# Altium schematic sheet Sensor.SchDoc
size A4
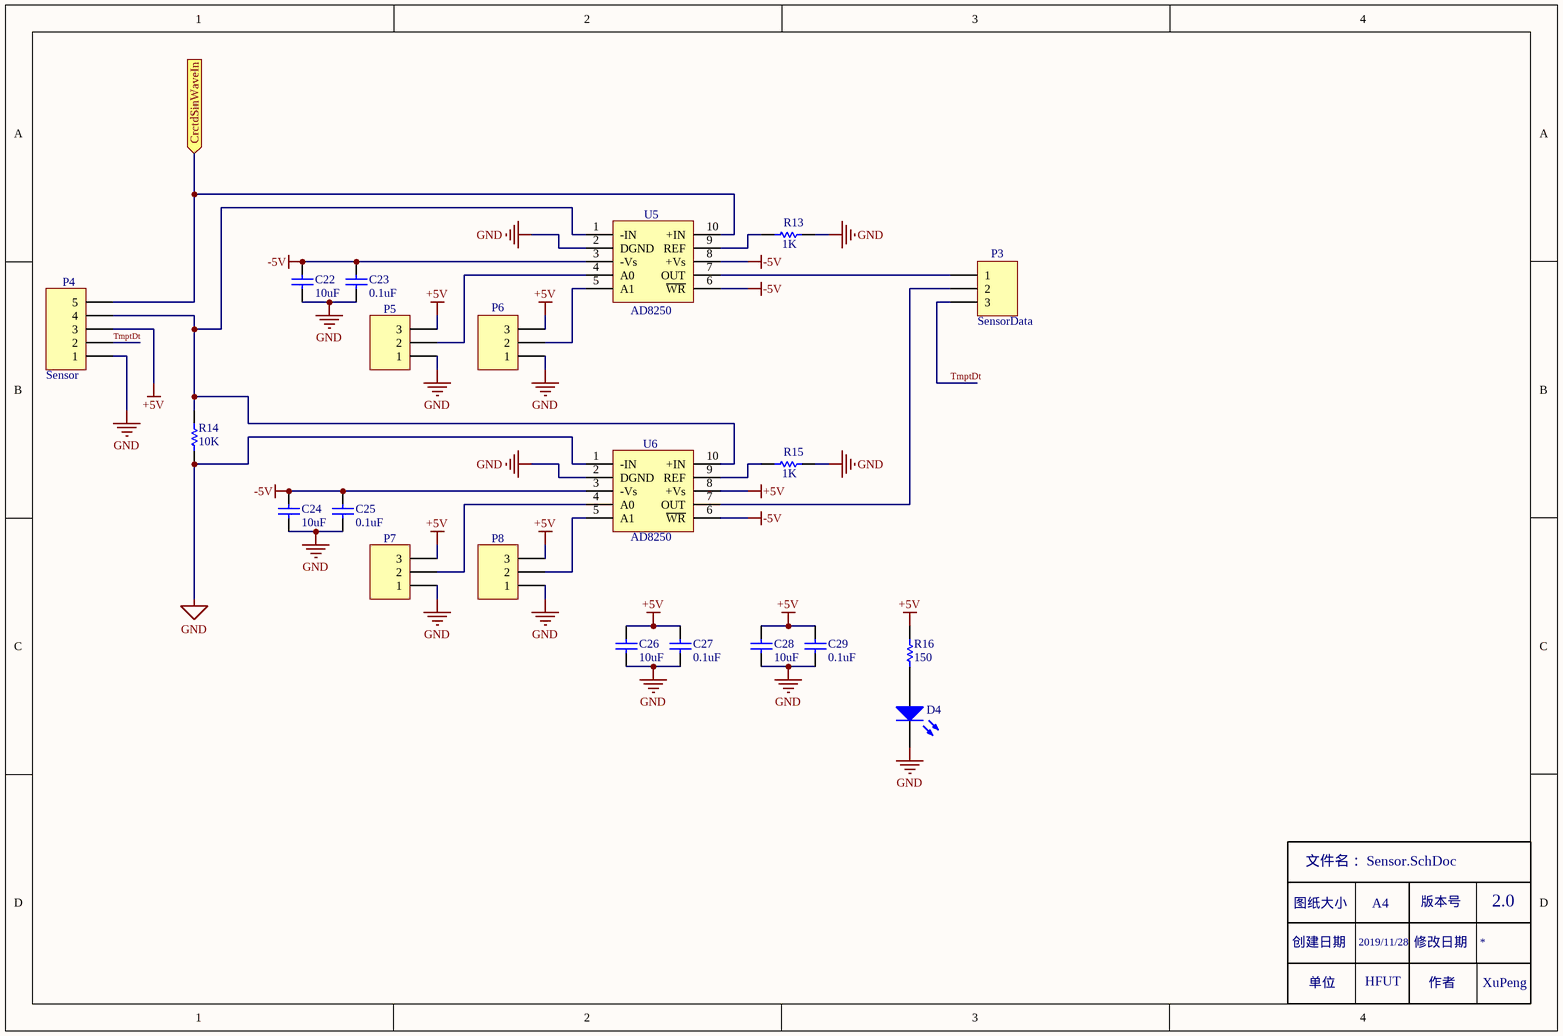
[diagram p0: Sensor.SchDoc]

## Parts
C22  value 10uF  [RB0.1/0.2]  (hidden comment: Cap)
C23  value 0.1uF  [C-RAD]  (hidden comment: Cap)
C24  value 10uF  [RB0.1/0.2]  (hidden comment: Cap)
C25  value 0.1uF  [C-RAD]  (hidden comment: Cap)
C26  value 10uF  [RB0.1/0.2]  (hidden comment: Cap)
C27  value 0.1uF  [C-RAD]  (hidden comment: Cap)
C28  value 10uF  [RB0.1/0.2]  (hidden comment: Cap)
C29  value 0.1uF  [C-RAD]  (hidden comment: Cap)
D4  LED0  [RB2.54/4]  (value not drawn)
P3  SensorData  [HDR1X3]
P4  Sensor  [HDR1X5]
P5  Header 3  [HDR1X3]  (value not drawn)
P6  Header 3  [HDR1X3]  (value not drawn)
P7  Header 3  [HDR1X3]  (value not drawn)
P8  Header 3  [HDR1X3]  (value not drawn)
R13  value 1K  [AXIAL-0.3]  (hidden comment: Res1)
R14  value 10K  [AXIAL-0.3]  (hidden comment: Res1)
R15  value 1K  [AXIAL-0.3]  (hidden comment: Res1)
R16  value 150  [AXIAL-0.3]  (hidden comment: Res1)
U5  AD8250  [MSOP10]
U6  AD8250  [MSOP10]

## Ports
CrctdSinWaveIn (in)

## Nets
+5V: C26.2 C27.2 C28.2 C29.2 P4.3 P5.3 P6.3 P7.3 P8.3 R16.2 U6.8(+Vs)
-5V: C22.2 C23.2 C24.2 C25.2 U5.3(-Vs) U5.6(~{WR}) U5.8(+Vs) U6.3(-Vs) U6.6(~{WR})
GND: C22.1 C23.1 C24.1 C25.1 C26.1 C27.1 C28.1 C29.1 D4.2(K) P4.1 P5.1 P6.1 P7.1 P8.1 R13.2 R14.1 R15.2 U5.2(DGND) U6.1(-IN) U6.2(DGND)
CrctdSinWaveIn: P4.5 U5.10(+IN) ; port CrctdSinWaveIn
TmptDt: P3.3 P4.2
NetD4_1: D4.1(A) R16.1
NetP3_1: P3.1 U5.7(OUT)
NetP3_2: P3.2 U6.7(OUT)
NetP4_4: P4.4 R14.2 U5.1(-IN) U6.10(+IN)
NetP5_2: P5.2 U5.4(A0)
NetP6_2: P6.2 U5.5(A1)
NetP7_2: P7.2 U6.4(A0)
NetP8_2: P8.2 U6.5(A1)
NetR13_1: R13.1 U5.9(REF)
NetR15_1: R15.1 U6.9(REF)

## Notes on the sheet
- 2.0
- 图纸大小
- 文件名：
- A4
- 版本号
- 创建日期
- 单位
- 2019/11/28
- HFUT
- 修改日期
- 作者
- XuPeng

## Library data of the parts
C22-C29 = Cap: 无极性电容; Published: 8-Jun-2000; PackageReference: RAD-0.3; Publisher: Altium Limited; LatestRevisionDate: 17-Jul-2002; LatestRevisionNote: Re-released for DXP Platform.
D4 = LED0: Typical INFRARED GaAs LED; Published: 8-Jun-2000; LatestRevisionDate: 08-Jul-2005; LatestRevisionNote: Mech Layer 1 removed.; PackageReference: LED-0; Publisher: Altium Limited; PackageDescription: LED; 2 Leads
P3 P5-P8 = Header 3: Header, 3-Pin; LatestRevisionDate: 17-Jul-2002; LatestRevisionNote: Re-released for DXP Platform.; Publisher: Altium Limited
P4 = Header 5: Header, 5-Pin; LatestRevisionDate: 17-Jul-2002; LatestRevisionNote: Re-released for DXP Platform.; Publisher: Altium Limited
R13-R16 = Res1: Resistor; Published: 8-Jun-2000; LatestRevisionDate: 17-Jul-2002; LatestRevisionNote: Re-released for DXP Platform.; PackageReference: AXIAL-0.3; Publisher: Altium Limited; PackageDescription: Axial Device, Thru-Hole; 2 Leads; 0.3 in Pin Spacing